# EasyEDA schematic schematic esyeda.json
TITLE: Sheet_1; REV: 1.0; Date: 2024-02-27; Sheet: 1/1; Drawn By: suppalerk p; Company: CompoundX
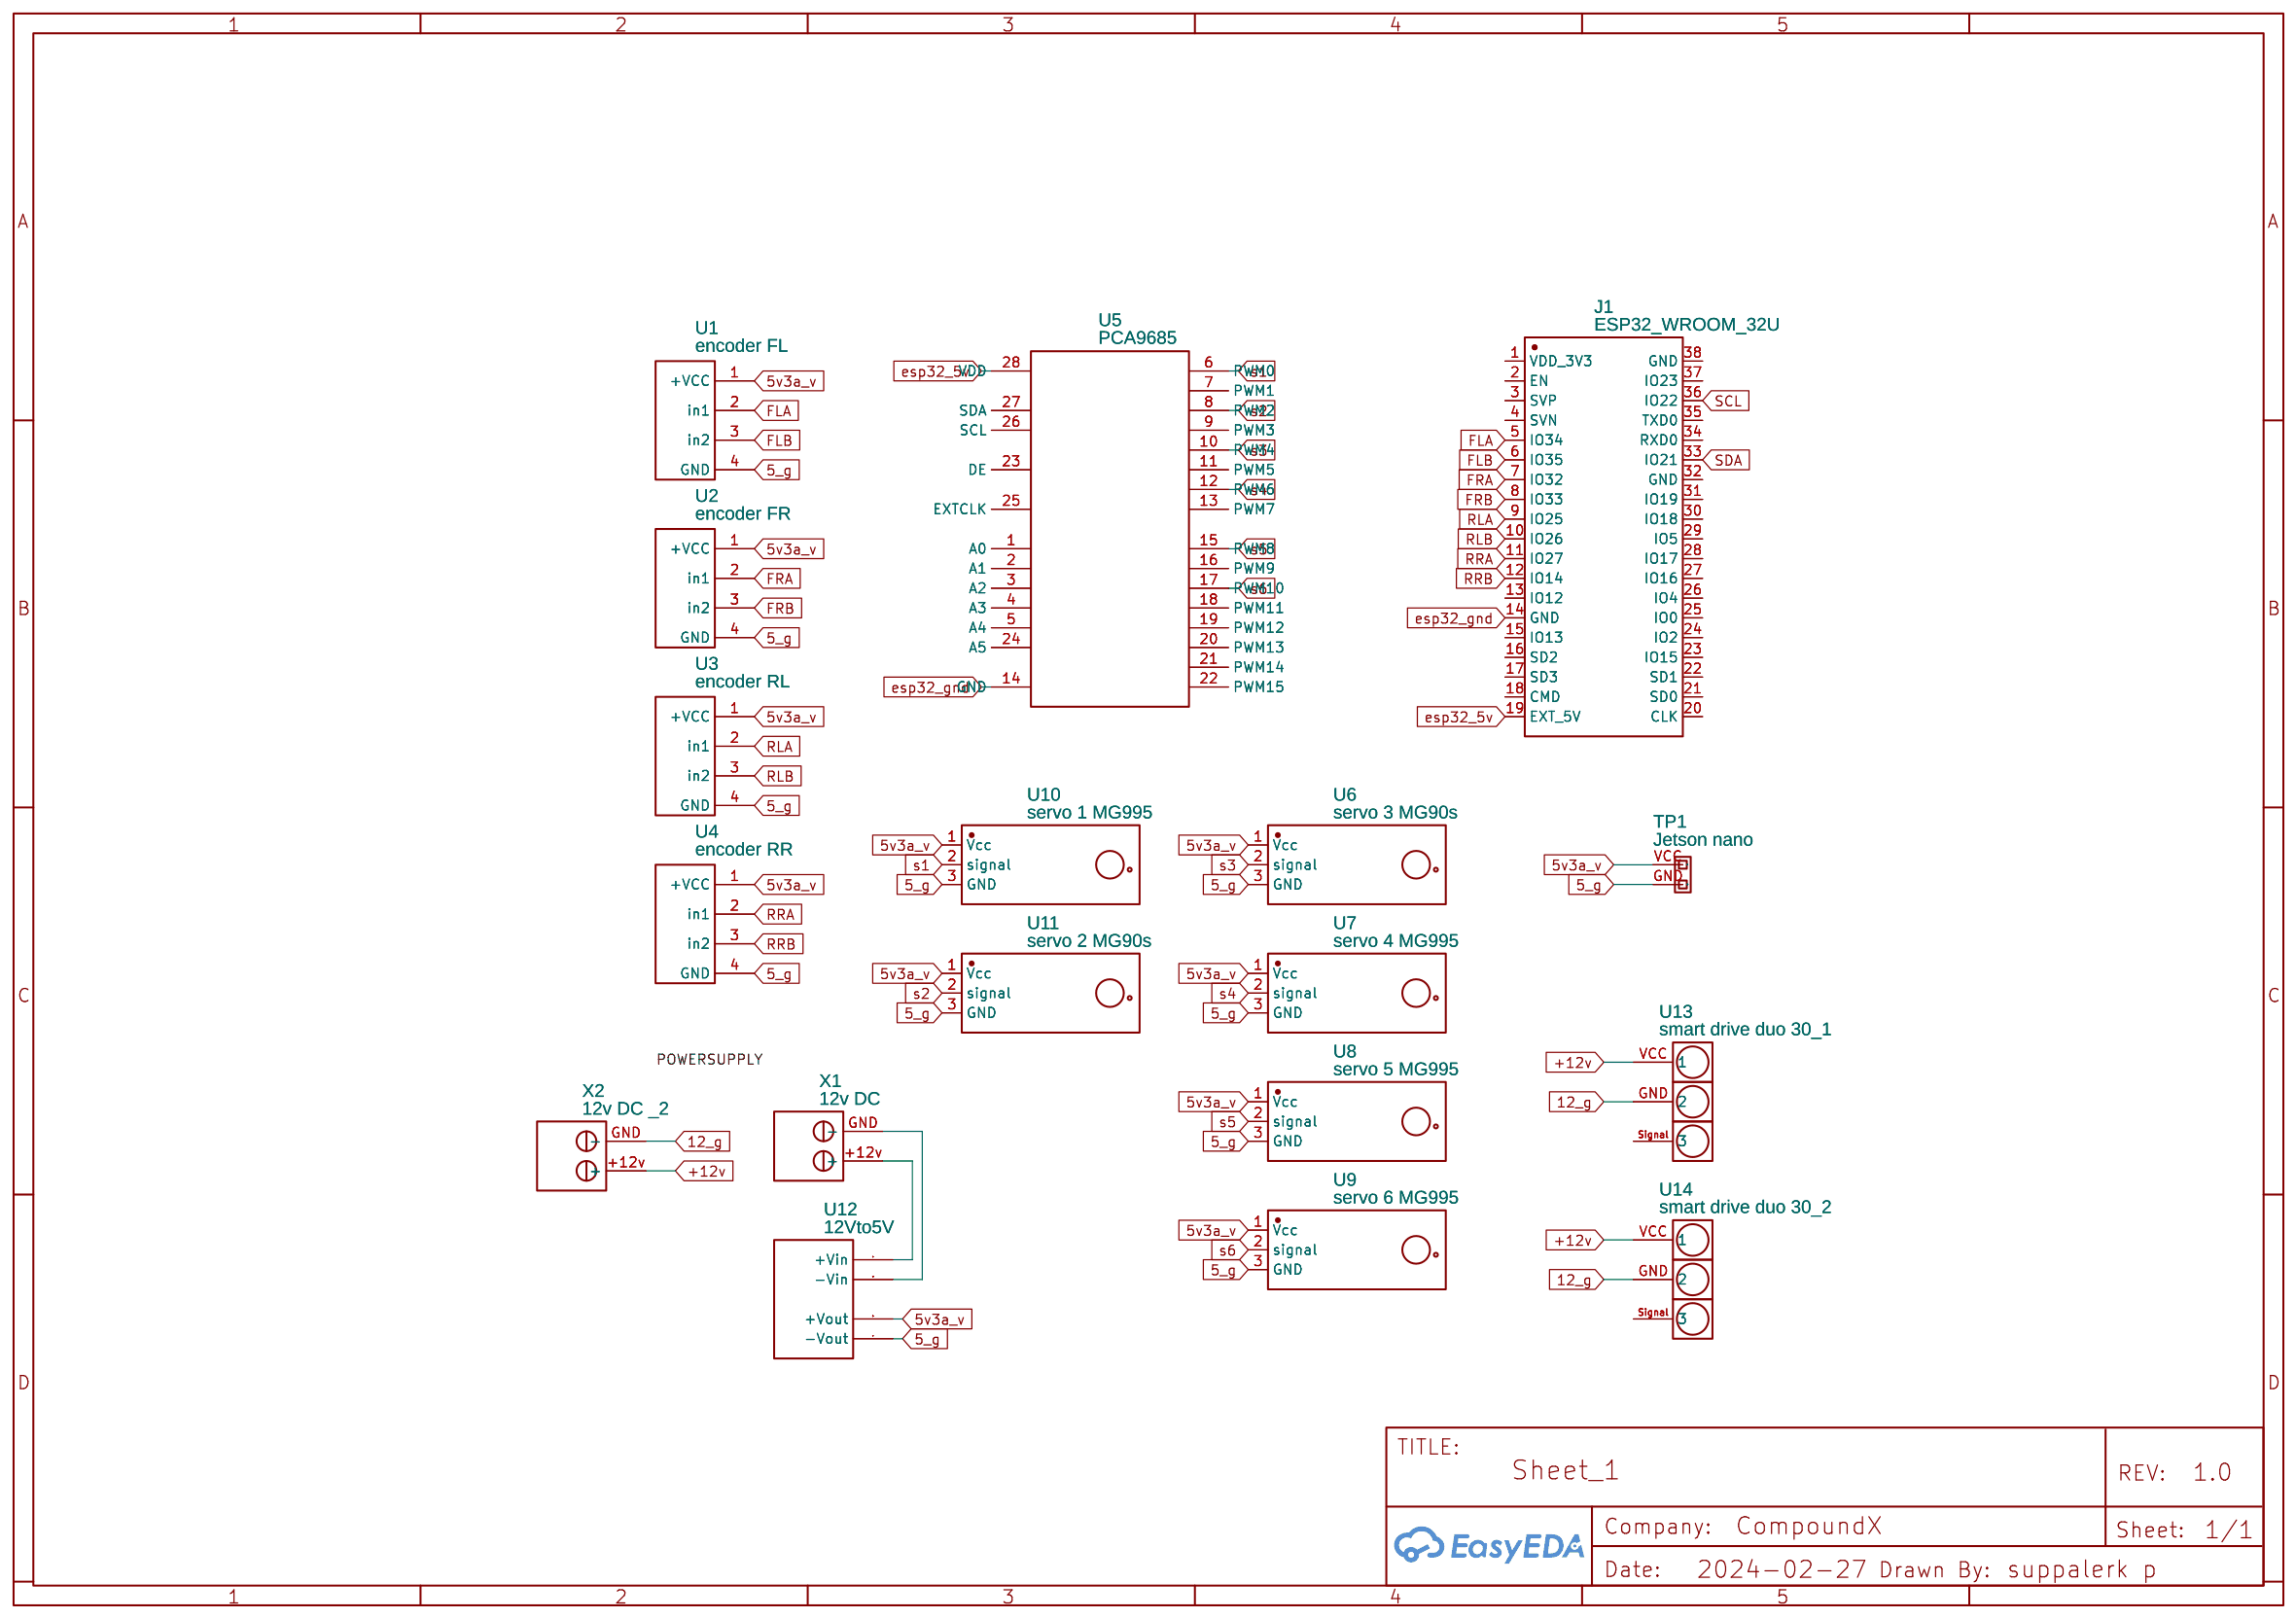
[diagram p0: schematic sheet]

## Parts
J1  ESP32_WROOM_32U  [ESP32_WROOM_32U]
TP1  Jetson nano  [2PIN-DIP]
U1  encoder FL  [CONNECTOR4PIN]
U2  encoder FR  [CONNECTOR4PIN]
U3  encoder RL  [CONNECTOR4PIN]
U4  encoder RR  [CONNECTOR4PIN]
U5  PCA9685  [TSSOP-28_L9.7-W4.4-P0.65-LS6.4-BL]
U6  servo 3 MG90s
U7  servo 4 MG995
U8  servo 5 MG995
U9  servo 6 MG995
U10  servo 1 MG995
U11  servo 2 MG90s
U12  12Vto5V
U13  smart drive duo 30_1  [10MM_SCREWTERMINAL_3P]
U14  smart drive duo 30_2  [10MM_SCREWTERMINAL_3P]
X1  12v DC  [2P TERMINAL SCREW BLOCK]
X2  12v DC _2  [2P TERMINAL SCREW BLOCK]

## Library data of the parts
J1 = ESP32_WROOM_32U: Contributor: Joint1k
TP1 = 2PIN: catid: 20; Contributor: Alex386; sim: true
U1-U4 = connector4Pin: catid: 20; Contributor: vlad_34; Supplier: vlad34; sim: true
U5 = PCA9685: catid: 20; link: https://cdn-shop.adafruit.com/datasheets/PCA9685.pdf; Contributor: jopagti; Manufacturer: NXP Semiconductors; sim: true
U6-U11 = MG995: catid: 20; Contributor: maytus udomlerd; sim: true
U12 = 12Vto5V: catid: 20; Contributor: adrielgff
U13 U14 = 10mm_screwterminal_3P: catid: 20; Contributor: Piet Kolkman
X1 X2 = 2PScrewTerminalBlock: catid: 20; Contributor: dbeaudry92; sim: true

## Nets
5v3a_v: TP1.VCC(1) U1.1(+VCC) U2.1(+VCC) U3.1(+VCC) U4.1(+VCC) U6.1(Vcc) U7.1(Vcc) U8.1(Vcc) U9.1(Vcc) U10.1(Vcc) U11.1(Vcc) U12.3(+Vout)
+12v: U13.VCC(1) U14.VCC(1) X2.+12v(+)
5_g: TP1.GND(2) U1.4(GND) U2.4(GND) U3.4(GND) U4.4(GND) U6.3(GND) U7.3(GND) U8.3(GND) U9.3(GND) U10.3(GND) U11.3(GND) U12.4(-Vout)
12_g: U13.GND(2) U14.GND(2) X2.GND(-)
esp32_5v: J1.19(EXT_5V)
esp32_gnd: J1.14(GND)
FLA: J1.5(IO34) U1.2(in1)
FLB: J1.6(IO35) U1.3(in2)
FRA: J1.7(IO32) U2.2(in1)
FRB: J1.8(IO33) U2.3(in2)
RLA: J1.9(IO25) U3.2(in1)
RLB: J1.10(IO26) U3.3(in2)
RRA: J1.11(IO27) U4.2(in1)
RRB: J1.12(IO14) U4.3(in2)
s1: U10.2(signal)
s2: U11.2(signal)
s3: U6.2(signal)
s4: U7.2(signal)
s5: U8.2(signal)
s6: U9.2(signal)
SCL: J1.36(IO22)
SDA: J1.33(IO21)
Net-(U12-1): U12.1(+Vin) X1.+12v(+)
Net-(U12-2): U12.2(-Vin) X1.GND(-)

Not connected (* = marked no-connect by the designer): J1 1(VDD_3V3) 2(EN) 3(SVP) 4(SVN) 13(IO12) 15(IO13) 16(SD2) 17(SD3) 18(CMD) 20(CLK) 21(SD0) 22(SD1) 23(IO15) 24(IO2) 25(IO0) 26(IO4) 27(IO16) 28(IO17) 29(IO5) 30(IO18) 31(IO19) 32(GND) 34(RXD0) 35(TXD0) 37(IO23) 38(GND); U5 1(A0) 2(A1) 3(A2) 4(A3) 5(A4) 6(PWM0) 7(PWM1) 8(PWM2) 9(PWM3) 10(PWM4) 11(PWM5) 12(PWM6) 13(PWM7) 14(GND) 15(PWM8) 16(PWM9) 17(PWM10) 18(PWM11) 19(PWM12) 20(PWM13) 21(PWM14) 22(PWM15) 23(DE) 24(A5) 25(EXTCLK) 26(SCL) 27(SDA) 28(VDD); U13 Signal(3); U14 Signal(3)
